# Altium schematic sheet TLC5940ControlBoard.SchDoc: TLC5940 Control Board
size Legal; DrawnBy: Christopher Wilcox; Engineer: Christopher Wilcox; Revision: 0; SheetNumber: 1; SheetTotal: 1
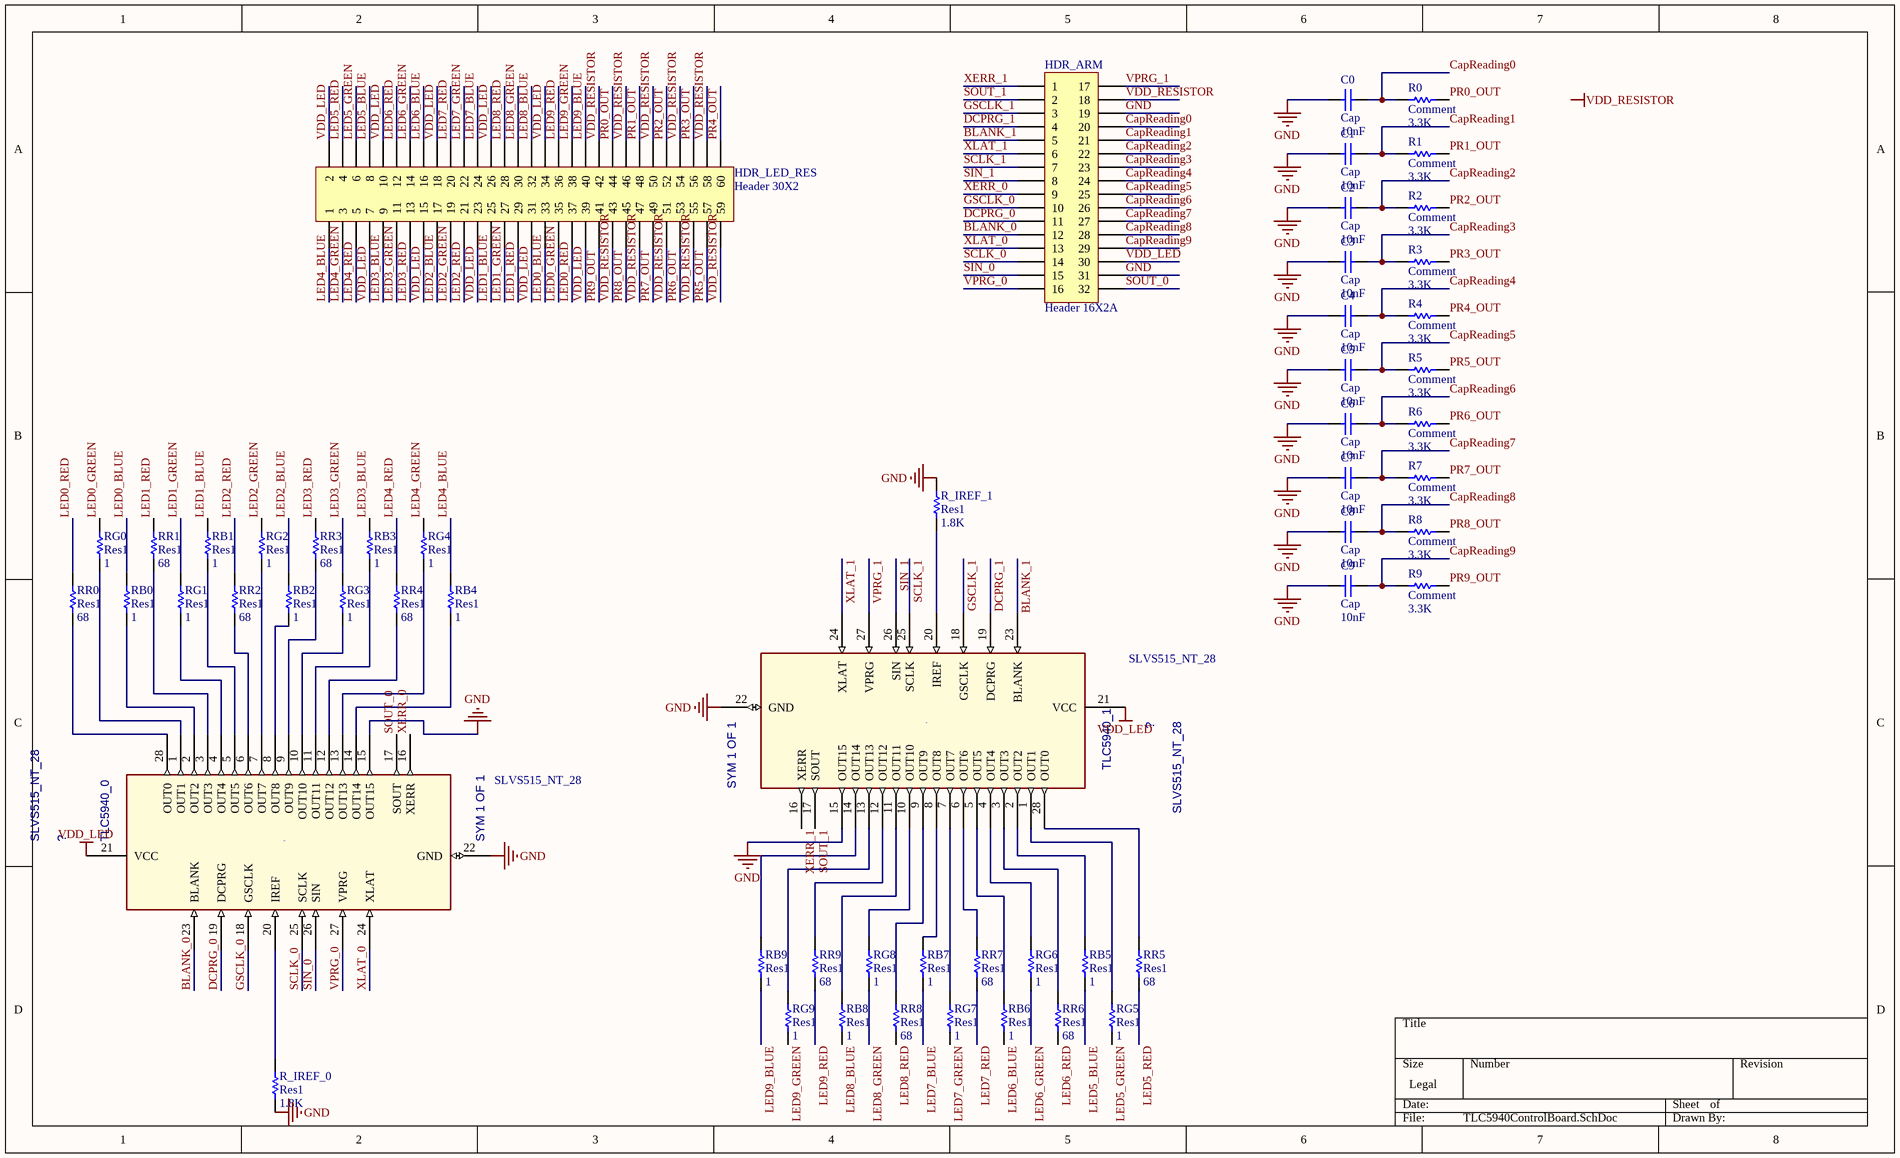
[diagram p0: TLC5940ControlBoard.SchDoc]

## Parts
C0  Cap  value 10nF  [CAPR2.54-5.1x3.2]
C1  Cap  value 10nF  [CAPR2.54-5.1x3.2]
C2  Cap  value 10nF  [CAPR2.54-5.1x3.2]
C3  Cap  value 10nF  [CAPR2.54-5.1x3.2]
C4  Cap  value 10nF  [CAPR2.54-5.1x3.2]
C5  Cap  value 10nF  [CAPR2.54-5.1x3.2]
C6  Cap  value 10nF  [CAPR2.54-5.1x3.2]
C7  Cap  value 10nF  [CAPR2.54-5.1x3.2]
C8  Cap  value 10nF  [CAPR2.54-5.1x3.2]
C9  Cap  value 10nF  [CAPR2.54-5.1x3.2]
HDR_ARM  Header 16X2A  [HDR2X16_CEN]
HDR_LED_RES  Header 30X2  [HDR2X30]
R0  Comment  value 3.3K  [AXIAL-0.3]
R1  Comment  value 3.3K  [AXIAL-0.3]
R2  Comment  value 3.3K  [AXIAL-0.3]
R3  Comment  value 3.3K  [AXIAL-0.3]
R4  Comment  value 3.3K  [AXIAL-0.3]
R5  Comment  value 3.3K  [AXIAL-0.3]
R6  Comment  value 3.3K  [AXIAL-0.3]
R7  Comment  value 3.3K  [AXIAL-0.3]
R8  Comment  value 3.3K  [AXIAL-0.3]
R9  Comment  value 3.3K  [AXIAL-0.3]
R_IREF_0  Res1  value 1.8K  [AXIAL-0.3]
R_IREF_1  Res1  value 1.8K  [AXIAL-0.3]
RB0  Res1  value 1  [AXIAL-0.3]
RB1  Res1  value 1  [AXIAL-0.3]
RB2  Res1  value 1  [AXIAL-0.3]
RB3  Res1  value 1  [AXIAL-0.3]
RB4  Res1  value 1  [AXIAL-0.3]
RB5  Res1  value 1  [AXIAL-0.3]
RB6  Res1  value 1  [AXIAL-0.3]
RB7  Res1  value 1  [AXIAL-0.3]
RB8  Res1  value 1  [AXIAL-0.3]
RB9  Res1  value 1  [AXIAL-0.3]
RG0  Res1  value 1  [AXIAL-0.3]
RG1  Res1  value 1  [AXIAL-0.3]
RG2  Res1  value 1  [AXIAL-0.3]
RG3  Res1  value 1  [AXIAL-0.3]
RG4  Res1  value 1  [AXIAL-0.3]
RG5  Res1  value 1  [AXIAL-0.3]
RG6  Res1  value 1  [AXIAL-0.3]
RG7  Res1  value 1  [AXIAL-0.3]
RG8  Res1  value 1  [AXIAL-0.3]
RG9  Res1  value 1  [AXIAL-0.3]
RR0  Res1  value 68  [AXIAL-0.3]
RR1  Res1  value 68  [AXIAL-0.3]
RR2  Res1  value 68  [AXIAL-0.3]
RR3  Res1  value 68  [AXIAL-0.3]
RR4  Res1  value 68  [AXIAL-0.3]
RR5  Res1  value 68  [AXIAL-0.3]
RR6  Res1  value 68  [AXIAL-0.3]
RR7  Res1  value 68  [AXIAL-0.3]
RR8  Res1  value 68  [AXIAL-0.3]
RR9  Res1  value 68  [AXIAL-0.3]
TLC5940_0  SLVS515_NT_28  SlotXofY: SYM 1 OF 1  [NT028]
TLC5940_1  SLVS515_NT_28  SlotXofY: SYM 1 OF 1  [NT028]

## Nets
GND: C0.1 C1.1 C2.1 C3.1 C4.1 C5.1 C6.1 C7.1 C8.1 C9.1 HDR_ARM.19 HDR_ARM.31 R_IREF_0.1 R_IREF_1.1 TLC5940_0.15(OUT15) TLC5940_0.22(GND) TLC5940_1.15(OUT15) TLC5940_1.22(GND)
VDD_LED: HDR_ARM.30 HDR_LED_RES.2 HDR_LED_RES.7 HDR_LED_RES.10 HDR_LED_RES.15 HDR_LED_RES.18 HDR_LED_RES.23 HDR_LED_RES.26 HDR_LED_RES.31 HDR_LED_RES.34 HDR_LED_RES.39 TLC5940_0.21(VCC) TLC5940_1.21(VCC)
VDD_RESISTOR: HDR_ARM.18 HDR_LED_RES.42 HDR_LED_RES.43 HDR_LED_RES.46 HDR_LED_RES.47 HDR_LED_RES.50 HDR_LED_RES.51 HDR_LED_RES.54 HDR_LED_RES.55 HDR_LED_RES.58 HDR_LED_RES.59
BLANK_0: HDR_ARM.12 TLC5940_0.23(BLANK)
BLANK_1: HDR_ARM.5 TLC5940_1.23(BLANK)
CapReading0: C0.2 HDR_ARM.20 R0.1
CapReading1: C1.2 HDR_ARM.21 R1.1
CapReading2: C2.2 HDR_ARM.22 R2.1
CapReading3: C3.2 HDR_ARM.23 R3.1
CapReading4: C4.2 HDR_ARM.24 R4.1
CapReading5: C5.2 HDR_ARM.25 R5.1
CapReading6: C6.2 HDR_ARM.26 R6.1
CapReading7: C7.2 HDR_ARM.27 R7.1
CapReading8: C8.2 HDR_ARM.28 R8.1
CapReading9: C9.2 HDR_ARM.29 R9.1
DCPRG_0: HDR_ARM.11 TLC5940_0.19(DCPRG)
DCPRG_1: HDR_ARM.4 TLC5940_1.19(DCPRG)
GSCLK_0: HDR_ARM.10 TLC5940_0.18(GSCLK)
GSCLK_1: HDR_ARM.3 TLC5940_1.18(GSCLK)
LED0_BLUE: HDR_LED_RES.33 RB0.2
LED0_GREEN: HDR_LED_RES.35 RG0.2
LED0_RED: HDR_LED_RES.37 RR0.2
LED1_BLUE: HDR_LED_RES.25 RB1.2
LED1_GREEN: HDR_LED_RES.27 RG1.2
LED1_RED: HDR_LED_RES.29 RR1.2
LED2_BLUE: HDR_LED_RES.17 RB2.2
LED2_GREEN: HDR_LED_RES.19 RG2.2
LED2_RED: HDR_LED_RES.21 RR2.2
LED3_BLUE: HDR_LED_RES.9 RB3.2
LED3_GREEN: HDR_LED_RES.11 RG3.2
LED3_RED: HDR_LED_RES.13 RR3.2
LED4_BLUE: HDR_LED_RES.1 RB4.2
LED4_GREEN: HDR_LED_RES.3 RG4.2
LED4_RED: HDR_LED_RES.5 RR4.2
LED5_BLUE: HDR_LED_RES.8 RB5.2
LED5_GREEN: HDR_LED_RES.6 RG5.2
LED5_RED: HDR_LED_RES.4 RR5.2
LED6_BLUE: HDR_LED_RES.16 RB6.2
LED6_GREEN: HDR_LED_RES.14 RG6.2
LED6_RED: HDR_LED_RES.12 RR6.2
LED7_BLUE: HDR_LED_RES.24 RB7.2
LED7_GREEN: HDR_LED_RES.22 RG7.2
LED7_RED: HDR_LED_RES.20 RR7.2
LED8_BLUE: HDR_LED_RES.32 RB8.2
LED8_GREEN: HDR_LED_RES.30 RG8.2
LED8_RED: HDR_LED_RES.28 RR8.2
LED9_BLUE: HDR_LED_RES.40 RB9.2
LED9_GREEN: HDR_LED_RES.38 RG9.2
LED9_RED: HDR_LED_RES.36 RR9.2
PR0_OUT: HDR_LED_RES.44 R0.2
PR1_OUT: HDR_LED_RES.48 R1.2
PR2_OUT: HDR_LED_RES.52 R2.2
PR3_OUT: HDR_LED_RES.56 R3.2
PR4_OUT: HDR_LED_RES.60 R4.2
PR5_OUT: HDR_LED_RES.57 R5.2
PR6_OUT: HDR_LED_RES.53 R6.2
PR7_OUT: HDR_LED_RES.49 R7.2
PR8_OUT: HDR_LED_RES.45 R8.2
PR9_OUT: HDR_LED_RES.41 R9.2
SCLK_0: HDR_ARM.14 TLC5940_0.25(SCLK)
SCLK_1: HDR_ARM.7 TLC5940_1.25(SCLK)
SIN_0: HDR_ARM.15 TLC5940_0.26(SIN)
SIN_1: HDR_ARM.8 TLC5940_1.26(SIN)
SOUT_0: HDR_ARM.32 TLC5940_0.17(SOUT)
SOUT_1: HDR_ARM.2 TLC5940_1.17(SOUT)
VPRG_0: HDR_ARM.16 TLC5940_0.27(VPRG)
VPRG_1: HDR_ARM.17 TLC5940_1.27(VPRG)
XERR_0: HDR_ARM.9 TLC5940_0.16(XERR)
XERR_1: HDR_ARM.1 TLC5940_1.16(XERR)
XLAT_0: HDR_ARM.13 TLC5940_0.24(XLAT)
XLAT_1: HDR_ARM.6 TLC5940_1.24(XLAT)
NetR_IREF_0_2: R_IREF_0.2 TLC5940_0.20(IREF)
NetR_IREF_1_2: R_IREF_1.2 TLC5940_1.20(IREF)
NetRB0_1: RB0.1 TLC5940_0.2(OUT2)
NetRB1_1: RB1.1 TLC5940_0.5(OUT5)
NetRB2_1: RB2.1 TLC5940_0.8(OUT8)
NetRB3_1: RB3.1 TLC5940_0.11(OUT11)
NetRB4_1: RB4.1 TLC5940_0.14(OUT14)
NetRB5_1: RB5.1 TLC5940_1.2(OUT2)
NetRB6_1: RB6.1 TLC5940_1.5(OUT5)
NetRB7_1: RB7.1 TLC5940_1.8(OUT8)
NetRB8_1: RB8.1 TLC5940_1.11(OUT11)
NetRB9_1: RB9.1 TLC5940_1.14(OUT14)
NetRG0_1: RG0.1 TLC5940_0.1(OUT1)
NetRG1_1: RG1.1 TLC5940_0.4(OUT4)
NetRG2_1: RG2.1 TLC5940_0.7(OUT7)
NetRG3_1: RG3.1 TLC5940_0.10(OUT10)
NetRG4_1: RG4.1 TLC5940_0.13(OUT13)
NetRG5_1: RG5.1 TLC5940_1.1(OUT1)
NetRG6_1: RG6.1 TLC5940_1.4(OUT4)
NetRG7_1: RG7.1 TLC5940_1.7(OUT7)
NetRG8_1: RG8.1 TLC5940_1.10(OUT10)
NetRG9_1: RG9.1 TLC5940_1.13(OUT13)
NetRR0_1: RR0.1 TLC5940_0.28(OUT0)
NetRR1_1: RR1.1 TLC5940_0.3(OUT3)
NetRR2_1: RR2.1 TLC5940_0.6(OUT6)
NetRR3_1: RR3.1 TLC5940_0.9(OUT9)
NetRR4_1: RR4.1 TLC5940_0.12(OUT12)
NetRR5_1: RR5.1 TLC5940_1.28(OUT0)
NetRR6_1: RR6.1 TLC5940_1.3(OUT3)
NetRR7_1: RR7.1 TLC5940_1.6(OUT6)
NetRR8_1: RR8.1 TLC5940_1.9(OUT9)
NetRR9_1: RR9.1 TLC5940_1.12(OUT12)

## Notes on the sheet
- Labels drawn without touching a wire or pin: VDD_RESISTOR

## Library data of the parts
C0-C9 = Cap: Capacitor; Published: 8-Jun-2000; LatestRevisionDate: 17-Jul-2002; LatestRevisionNote: Re-released for DXP Platform.; PackageReference: RAD-0.3; Publisher: Altium Limited
HDR_ARM = Header 16X2A: Header, 16-Pin, Dual row; LatestRevisionDate: 17-Jul-2002; LatestRevisionNote: Re-released for DXP Platform.; Publisher: Altium Limited
HDR_LED_RES = Header 30X2: Header, 30-Pin, Dual row; LatestRevisionDate: 17-Jul-2002; LatestRevisionNote: Re-released for DXP Platform.; Publisher: Altium Limited
R0-R9 R_IREF_0 R_IREF_1 RB0-RB9 RG0-RG9 RR0-RR9 = Res1: Resistor; Published: 8-Jun-2000; LatestRevisionDate: 17-Jul-2002; LatestRevisionNote: Re-released for DXP Platform.; PackageReference: AXIAL-0.3; Publisher: Altium Limited
TLC5940_0 TLC5940_1 = SLVS515_NT_28: Instance: ?; SymName: SLVS515_NT_28; RefLocation: ?; BoardLocation: ?